# Altium schematic sheet PowerBoard.SchDoc: Powerboard interface
size A4; Organization: Institut d'Automatisation Industrielle; SheetNumber: 1; SheetTotal: 2; SVN: OUI; CurrentTime: 6; CurrentDate: 5; DocumentFullPathAndName: 8; DocumentName: 9; ModifiedDate: 13; ProjectName: <projet>
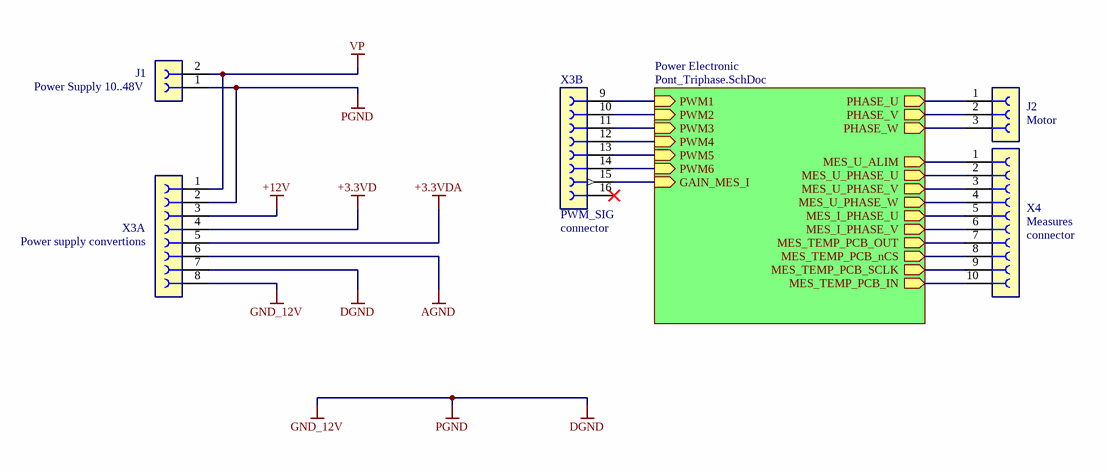
[diagram p0: PowerBoard.SchDoc]

## Parts
J1  Use: Power Supply 10..48V  [CONNECT2PIN]  (hidden comment: CONNECT 2pos 90°)
J2  Use: Motor  [CONNECT3PIN]  (hidden comment: CONNECT 3pos 90°)
X3  Use: Power supply convertions  [62301621021]  (hidden comment: CONNECT SMD 16pos 2row 180°)  (parts A,B of 2)
X4  Use: Measures  system: connector  [62301021021]  (hidden comment: CONNECT SMD 10pos 2row 180°)

## Sub-sheets
Power Electronic = Pont_Triphase.SchDoc: MES_I_PHASE_U (out), MES_I_PHASE_V (out), PHASE_W (out), MES_U_ALIM (out), MES_U_PHASE_W (out), PHASE_V (out), PHASE_U (out), PWM2 (in), PWM3 (in), PWM4 (in), PWM5 (in), PWM1 (in), PWM6 (in), MES_U_PHASE_U (out), MES_U_PHASE_V (out), MES_TEMP_PCB_nCS (out), MES_TEMP_PCB_SCLK (out), MES_TEMP_PCB_OUT (out), MES_TEMP_PCB_IN (out), GAIN_MES_I (in)

## Nets
+3.3VD: X3.4
+3.3VDA: X3.5
+12V: X3.3
AGND: X3.6
DGND: J1.1 X3.2 X3.7 X3.8  [also labelled GND_12V, PGND]
VP: J1.2 X3.1
NetJ2_1: J2.1 ; sheet Power Electronic/PHASE_U
NetJ2_2: J2.2 ; sheet Power Electronic/PHASE_V
NetJ2_3: J2.3 ; sheet Power Electronic/PHASE_W
NetX3_9: X3.9 ; sheet Power Electronic/PWM1
NetX3_10: X3.10 ; sheet Power Electronic/PWM2
NetX3_11: X3.11 ; sheet Power Electronic/PWM3
NetX3_12: X3.12 ; sheet Power Electronic/PWM4
NetX3_13: X3.13 ; sheet Power Electronic/PWM5
NetX3_14: X3.14 ; sheet Power Electronic/PWM6
NetX3_15: X3.15 ; sheet Power Electronic/GAIN_MES_I
NetX4_1: X4.1 ; sheet Power Electronic/MES_U_ALIM
NetX4_2: X4.2 ; sheet Power Electronic/MES_U_PHASE_U
NetX4_3: X4.3 ; sheet Power Electronic/MES_U_PHASE_V
NetX4_4: X4.4 ; sheet Power Electronic/MES_U_PHASE_W
NetX4_5: X4.5 ; sheet Power Electronic/MES_I_PHASE_U
NetX4_6: X4.6 ; sheet Power Electronic/MES_I_PHASE_V
NetX4_7: X4.7 ; sheet Power Electronic/MES_TEMP_PCB_OUT
NetX4_8: X4.8 ; sheet Power Electronic/MES_TEMP_PCB_nCS
NetX4_9: X4.9 ; sheet Power Electronic/MES_TEMP_PCB_SCLK
NetX4_10: X4.10 ; sheet Power Electronic/MES_TEMP_PCB_IN

Not connected (* = marked no-connect by the designer): X3 16*

## Notes on the sheet
- Title
- Institut d'automatisation industrielle
  rte de Cheseaux 1
  CH-1401 Yverdon-les-Bains
  T +41(0)24 55 77 377    F +41(0)24 55 76 320
  http://iai.heig-vd.ch       iai@heig-vd.ch
- Date:
- Size:
- A4
- Project:
- Sheet
- of
- No.
- Author:
- SVN
- Version
- File:

## Library data of the parts
J1 = CONNECT 2pos 90° 3.81mm: 2 Positions, bloc de jonction Embase, broche mâle, gainée (4 côtés) 0,150 po (3,81mm) 90°, engle droit Trou traversant; Value: WR-TBL322; Supplier 1: Digi-Key; Supplier Part Number 1: 277-2315-1-ND
J2 = CONNECT 3pos 90° 3.81mm: 3 Positions, bloc de jonction Embase, broche mâle, gainée (4 côtés) 0,150 po (3,81mm) 90°, engle droit Trou traversant; Value: WR-TBL322; Supplier 1: Digi-Key; Supplier Part Number 1: 277-2316-1-ND
X3 = CONNECT SMD 16pos 180° 1.27mm 2row: Value: 62301621021; Supplier 1: Newark; Supplier Part Number 1: 47AC7230
X4 = CONNECT SMD 10pos 180° 1.27mm 2row: Value: 62301021021; Supplier 1: RSComponents; Supplier Part Number 1: 2053195